# EAGLE schematic Marshmallow (EAGLE 6.6.0)
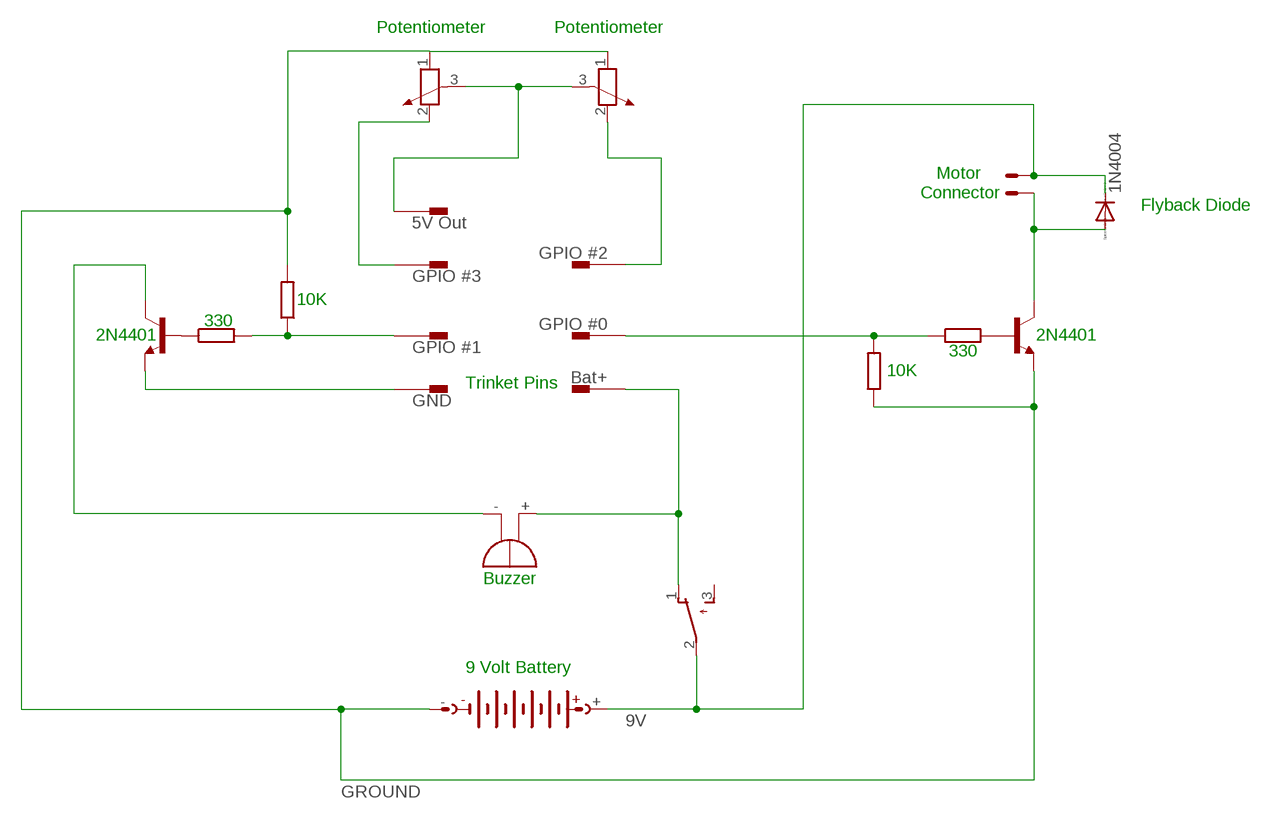
[diagram p0: schematic, sheet 1]

## Parts
D1  1N4004  [DO41-10]
G1  AB9V  [AB9V]
J1  GPIO #1  PIN1-2  [62221]
J2  GND  PIN1-2  [62221]
J3  GPIO #0  PIN1-2  [62221]
J4  Bat+  PIN1-2  [62221]
J5  GPIO #2  PIN1-2  [62221]
J6  GPIO #3  PIN1-2  [62221]
J7  5V Out  PIN1-2  [62221]
R5  POTENTIOMETER_PT-10  [PT-10]
R6  POTENTIOMETER_PT-10  [PT-10]
S1  TL32PO  [TL3XPO]
SG2  F/BC35  [F/BC35]
T1  2N4401-NPN-TO92-EBC  [TO92-EBC]
T2  2N4401-NPN-TO92-EBC  [TO92-EBC]
X2  22-23-2021  [22-23-2021]

## Nets
9V: D1.C G1.+ S1.2(P) X2.2
GROUND: G1.- R5.1 R6.1 T1.E
N$1: J6.1 R5.2
N$2: J5.1 R6.2
N$3: D1.A T1.C X2.1
N$4: J3.1
N$5: J4.1 S1.1(O) SG2.+
N$6: J1.1
N$7: SG2.- T2.C
N$8: J7.1 R5.3 R6.3
N$10: J2.1 T2.E
Unconnected: S1.3(S) T1.B T2.B

## Notes on the sheet
- Potentiometer | Potentiometer
- Motor
- Connector
- Flyback Diode
- 10K
- 330
- 2N4401 | 2N4401
- 330
- 10K
- Trinket Pins
- Buzzer
- 9 Volt Battery

## Library data of the parts
D1 = diode:1N4004: DIODE general purpose rectifier, 1 A
G1 = battery:AB9V: 9-V BATTERY CLIP
J1-J7 = con-faston:PIN1-2: CONN TAB FASTON BRASS .187 PCB TAB, FSSTON, DUAL STAKE, .187 SERIES Digi-Key Part Number: A24734CT-ND Source: Tyco Electronics Corporation .. ENG_CD_62221_R.pdf http://search.digikey.com/scripts/DkSearch/dksus.dll?Detail&name=A24734CT-ND; MF: TYCO ELECTRONICS; MPN: 62221-1; OC_FARNELL: unknown; OC_NEWARK: 16H2318
R5 R6 = rcl:POTENTIOMETER_: Potentiometer
S1 = switch:TL32PO: TINY SWITCH ON - MOM Source: http://www2.produktinfo.conrad.com/datenblaetter/700000-724999/705152-da-01-de-Subminiaturschalter_TL_36YO.pdf
SG2 = buzzer:F/BC35: BUZZER Source: Spoerle; OC_FARNELL: unknown; OC_NEWARK: unknown
T1 T2 = transistor-neu-to92:*-NPN-: NPN Transistror
X2 = con-molex:22-23-2021: .100" (2.54mm) Center Header - 2 Pin; MF: MOLEX; MPN: 22-23-2021; OC_FARNELL: 1462926; OC_NEWARK: 25C3832